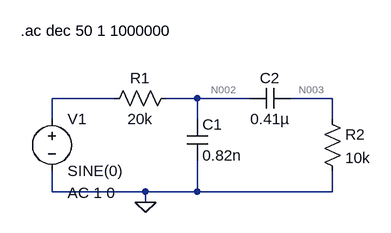
[diagram p0: schematic BPF.asc]
BPF.asc, the LTspice schematic file:
Version 4
SHEET 1 880 680
WIRE 128 80 32 80
WIRE 256 80 208 80
WIRE 336 80 256 80
WIRE 464 80 400 80
WIRE 32 112 32 80
WIRE 256 112 256 80
WIRE 464 112 464 80
WIRE 32 224 32 192
WIRE 176 224 32 224
WIRE 256 224 256 176
WIRE 256 224 176 224
WIRE 464 224 464 192
WIRE 464 224 256 224
WIRE 176 240 176 224
FLAG 176 240 0
SYMBOL voltage 32 96 R0
WINDOW 123 24 130 Left 2
WINDOW 39 0 0 Left 0
SYMATTR InstName V1
SYMATTR Value SINE(0)
SYMATTR Value2 AC 1 0
SYMBOL res 112 96 R270
WINDOW 0 32 56 VTop 2
WINDOW 3 0 56 VBottom 2
SYMATTR InstName R1
SYMATTR Value 20k
SYMBOL cap 240 112 R0
SYMATTR InstName C1
SYMATTR Value 0.82n
SYMBOL cap 400 64 R90
WINDOW 0 0 32 VBottom 2
WINDOW 3 32 32 VTop 2
SYMATTR InstName C2
SYMATTR Value 0.41µ
SYMBOL res 448 96 R0
SYMATTR InstName R2
SYMATTR Value 10k
TEXT -16 -24 Left 2 !.ac dec 50 1 1000000

The netlist it stands for:
* BPF.asc
V1 N001 0 SINE(0) AC 1 0
R1 N001 N002 20k
C1 N002 0 0.82n
C2 N003 N002 0.41µ
R2 N003 0 10k
.ac dec 50 1 1000000
.backanno
.end

* Results of the author's LTspice run, read from the files saved beside the schematic
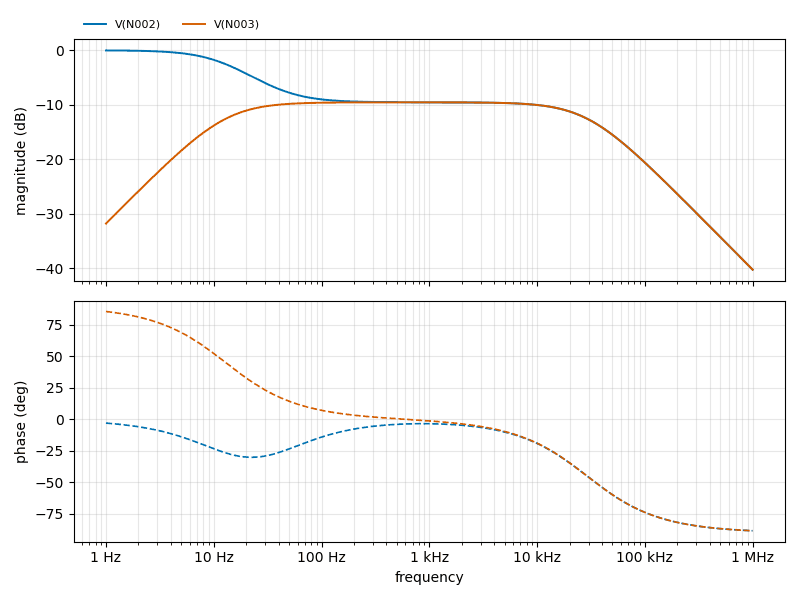
[diagram p1: AC Analysis of BPF.asc, plotted from the saved traces]
* AC Analysis, 1 run:
*   V(N002): -0.02 dB at 1 Hz, -40.26 dB at 1 MHz, peak -0.02 dB at 1 Hz, 3 dB below the peak at 14.74 Hz
*   V(N003): -31.81 dB at 1 Hz, -40.26 dB at 1 MHz, peak -9.55 dB at 602.6 Hz, 3 dB below the peak at 12.92 Hz and 29.16 kHz